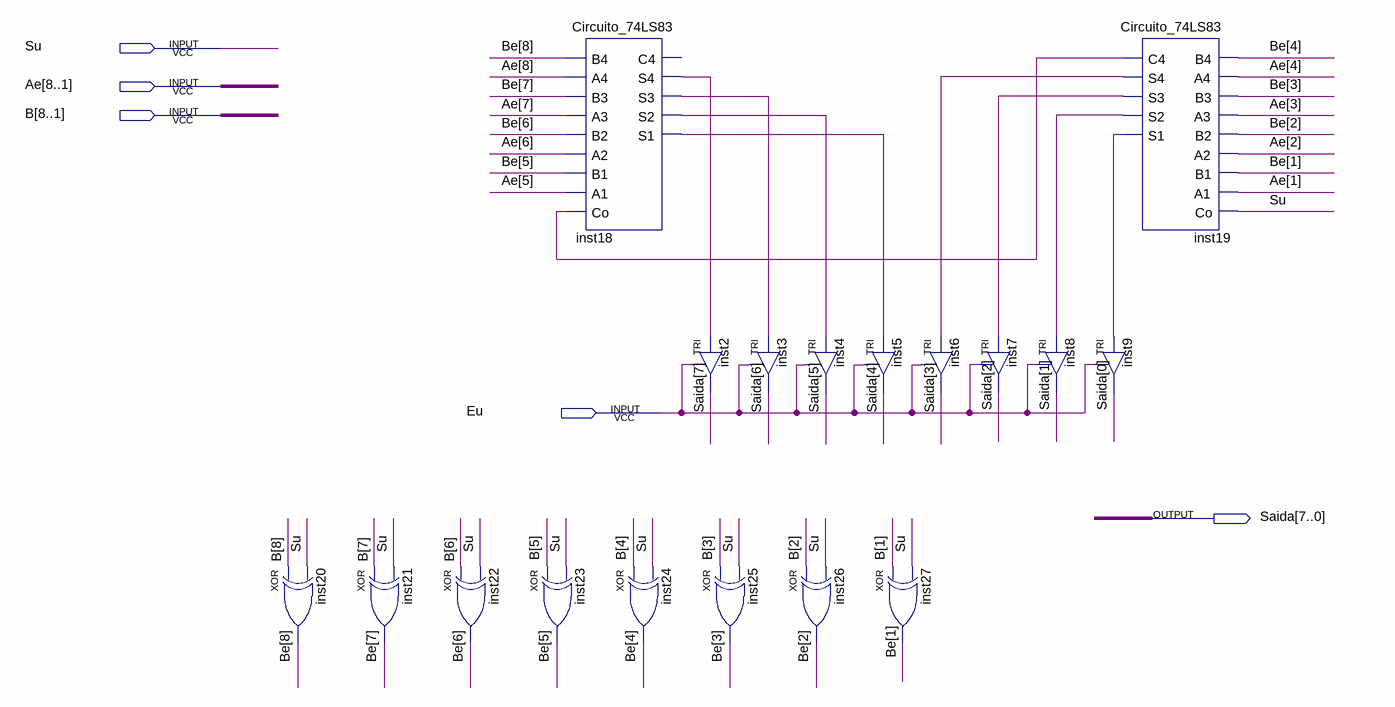
[diagram p0: schematic sheet]
// Quartus schematic Somador_subtrator.bdf as structural Verilog: 18 symbols, 5 pins
module Somador_subtrator (
  input  Su,
  input  [8:1] Ae,
  input  [8:1] B,
  input  Eu,
  output [7:0] Saida
);

  wire inst18_s1, inst18_s2, inst18_s3, inst18_s4, inst19_c4, inst19_s1, inst19_s2, inst19_s3, inst19_s4;
  wire [8:1] Be;

  xor inst20 (Be[8], B[8], Su);
  xor inst21 (Be[7], B[7], Su);
  xor inst22 (Be[6], B[6], Su);
  xor inst23 (Be[5], B[5], Su);
  Circuito_74LS83 inst18 (
    .B4(Be[8]), .A4(Ae[8]), .B3(Be[7]), .A3(Ae[7]), .B2(Be[6]), .A2(Ae[6]), .B1(Be[5]), .A1(Ae[5]),
    .Co(inst19_c4), .S4(inst18_s4), .S3(inst18_s3), .S2(inst18_s2), .S1(inst18_s1));  // open: C4
  xor inst24 (Be[4], B[4], Su);
  TRI inst2 (.IN(inst18_s4), .OE(Eu), .OUT(Saida[7]));
  TRI inst3 (.IN(inst18_s3), .OE(Eu), .OUT(Saida[6]));
  xor inst25 (Be[3], B[3], Su);
  TRI inst4 (.IN(inst18_s2), .OE(Eu), .OUT(Saida[5]));
  xor inst26 (Be[2], B[2], Su);
  TRI inst5 (.IN(inst18_s1), .OE(Eu), .OUT(Saida[4]));
  xor inst27 (Be[1], B[1], Su);
  TRI inst6 (.IN(inst19_s4), .OE(Eu), .OUT(Saida[3]));
  TRI inst7 (.IN(inst19_s3), .OE(Eu), .OUT(Saida[2]));
  TRI inst8 (.IN(inst19_s2), .OE(Eu), .OUT(Saida[1]));
  Circuito_74LS83 inst19 (
    .B4(Be[4]), .A4(Ae[4]), .B3(Be[3]), .A3(Ae[3]), .B2(Be[2]), .A2(Ae[2]), .B1(Be[1]), .A1(Ae[1]), .Co(Su),
    .C4(inst19_c4), .S4(inst19_s4), .S3(inst19_s3), .S2(inst19_s2), .S1(inst19_s1));
  TRI inst9 (.IN(inst19_s1), .OE(Eu), .OUT(Saida[0]));
endmodule
